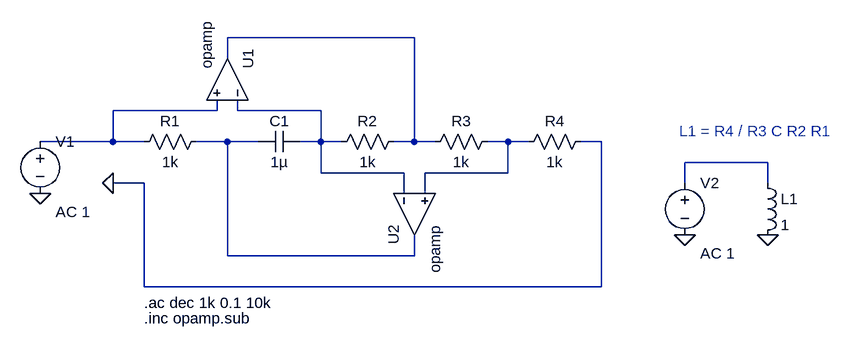
[diagram p0: schematic EJE5_A.asc]
EJE5_A.asc, the LTspice schematic file:
Version 4
SHEET 1 1044 680
WIRE 384 16 96 16
WIRE 96 48 96 16
WIRE 80 128 80 112
WIRE 80 128 -80 128
WIRE 112 128 112 112
WIRE 240 128 112 128
WIRE -80 176 -80 128
WIRE -80 176 -192 176
WIRE -32 176 -80 176
WIRE 96 176 48 176
WIRE 144 176 96 176
WIRE 240 176 240 128
WIRE 240 176 208 176
WIRE 272 176 240 176
WIRE 384 176 384 16
WIRE 384 176 352 176
WIRE 416 176 384 176
WIRE 528 176 496 176
WIRE 560 176 528 176
WIRE 672 176 640 176
WIRE 928 208 800 208
WIRE 240 224 240 176
WIRE 368 224 240 224
WIRE 528 224 528 176
WIRE 528 224 400 224
WIRE -32 240 -80 240
WIRE 800 240 800 208
WIRE 928 240 928 208
WIRE 368 256 368 224
WIRE 400 256 400 224
WIRE 96 352 96 176
WIRE 384 352 384 320
WIRE 384 352 96 352
WIRE -32 400 -32 240
WIRE 672 400 672 176
WIRE 672 400 -32 400
FLAG -80 240 0
FLAG -192 256 0
FLAG 800 320 0
FLAG 928 320 0
SYMBOL res 64 160 R90
WINDOW 0 0 56 VBottom 2
WINDOW 3 32 56 VTop 2
SYMATTR InstName R1
SYMATTR Value 1k
SYMBOL cap 208 160 R90
WINDOW 0 0 32 VBottom 2
WINDOW 3 32 32 VTop 2
SYMATTR InstName C1
SYMATTR Value 1µ
SYMBOL res 368 160 R90
WINDOW 0 0 56 VBottom 2
WINDOW 3 32 56 VTop 2
SYMATTR InstName R2
SYMATTR Value 1k
SYMBOL res 512 160 R90
WINDOW 0 0 56 VBottom 2
WINDOW 3 32 56 VTop 2
SYMATTR InstName R3
SYMATTR Value 1k
SYMBOL res 656 160 R90
WINDOW 0 0 56 VBottom 2
WINDOW 3 32 56 VTop 2
SYMATTR InstName R4
SYMATTR Value 1k
SYMBOL voltage -192 160 R0
WINDOW 123 24 124 Left 2
SYMATTR Value2 AC 1
SYMATTR InstName V1
SYMATTR Value ""
SYMBOL OpAmps\\opamp 160 80 M270
SYMATTR InstName U1
SYMATTR SpiceLine2 GBW=100Meg
SYMBOL OpAmps\\opamp 320 288 M90
SYMATTR InstName U2
SYMATTR SpiceLine2 GBW=100Meg
SYMBOL ind 912 224 R0
SYMATTR InstName L1
SYMATTR Value 1
SYMBOL voltage 800 224 R0
WINDOW 123 24 124 Left 2
SYMATTR Value2 AC 1
SYMATTR InstName V2
SYMATTR Value ""
TEXT -32 424 Left 2 !.ac dec 1k 0.1 10k
TEXT 792 160 Left 2 ;L1 = R4 / R3 C R2 R1
TEXT -32 448 Left 2 !.inc opamp.sub

The netlist it stands for:
* EJE5_A.asc
R1 N004 N002 1k
C1 N003 N004 1µ
R2 N001 N003 1k
R3 N005 N001 1k
R4 0 N005 1k
V1 N002 0 AC 1
XU1 N003 N002 N001 opamp Aol=100K GBW=100Meg  ; pins invin noninvin out
XU2 N003 N005 N004 opamp Aol=100K GBW=100Meg  ; pins invin noninvin out
L1 N006 0 1
V2 N006 0 AC 1
.ac dec 1k 0.1 10k
* L1 = R4 / R3 C R2 R1
.inc opamp.sub
.backanno
.end